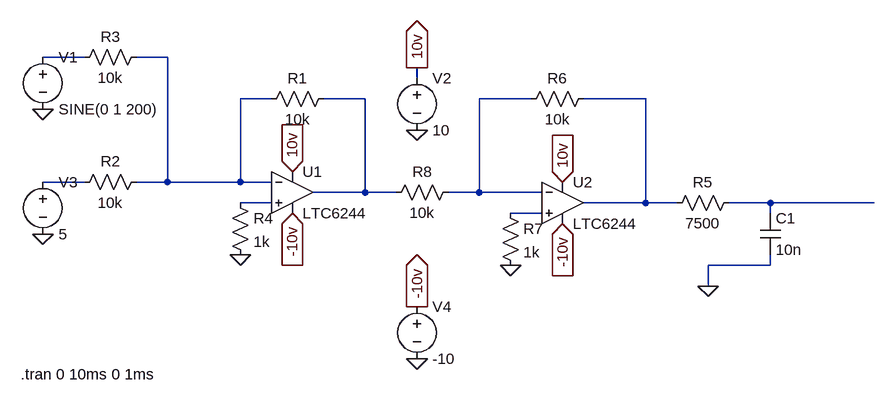
[diagram p0: schematic summing opamp.asc]
summing opamp.asc, the LTspice schematic file:
Version 4
SHEET 1 1268 680
WIRE -128 -80 -192 -80
WIRE 0 -80 -48 -80
WIRE 384 -48 384 -64
WIRE 160 -16 112 -16
WIRE 304 -16 240 -16
WIRE 560 -16 480 -16
WIRE 736 -16 640 -16
WIRE -128 112 -192 112
WIRE 0 112 0 -80
WIRE 0 112 -48 112
WIRE 112 112 112 -16
WIRE 112 112 0 112
WIRE 160 112 112 112
WIRE 304 128 304 -16
WIRE 304 128 224 128
WIRE 352 128 304 128
WIRE 480 128 480 -16
WIRE 480 128 432 128
WIRE 576 128 480 128
WIRE 160 144 112 144
WIRE 736 144 736 -16
WIRE 736 144 640 144
WIRE 784 144 736 144
WIRE 928 144 864 144
WIRE 1088 144 928 144
WIRE 576 160 528 160
WIRE 928 160 928 144
WIRE 928 240 928 224
WIRE 928 240 832 240
WIRE 832 272 832 240
FLAG 384 32 0
FLAG -192 192 0
FLAG 112 224 0
FLAG 384 384 0
FLAG -192 0 0
FLAG 832 272 0
FLAG 528 240 0
FLAG 384 -64 10v
IOPIN 384 -64 Out
FLAG 192 96 10v
IOPIN 192 96 In
FLAG 384 304 -10v
IOPIN 384 304 Out
FLAG 608 112 10v
IOPIN 608 112 In
FLAG 192 160 -10v
IOPIN 192 160 In
FLAG 608 176 -10v
IOPIN 608 176 In
SYMBOL OpAmps\\LTC6244 192 128 R0
SYMATTR InstName U1
SYMBOL res 256 -32 R90
WINDOW 0 0 56 VBottom 2
WINDOW 3 32 56 VTop 2
SYMATTR InstName R1
SYMATTR Value 10k
SYMBOL res -32 96 R90
WINDOW 0 0 56 VBottom 2
WINDOW 3 32 56 VTop 2
SYMATTR InstName R2
SYMATTR Value 10k
SYMBOL res -32 -96 R90
WINDOW 0 0 56 VBottom 2
WINDOW 3 32 56 VTop 2
SYMATTR InstName R3
SYMATTR Value 10k
SYMBOL voltage -192 96 R0
SYMATTR InstName V3
SYMATTR Value 5
SYMBOL res 96 128 R0
SYMATTR InstName R4
SYMATTR Value 1k
SYMBOL voltage 384 288 R0
SYMATTR InstName V4
SYMATTR Value -10
SYMBOL voltage -192 -96 R0
WINDOW 123 0 0 Left 0
WINDOW 39 0 0 Left 0
SYMATTR InstName V1
SYMATTR Value SINE(0 1 200)
SYMBOL voltage 384 -64 R0
SYMATTR InstName V2
SYMATTR Value 10
SYMBOL cap 912 160 R0
SYMATTR InstName C1
SYMATTR Value 10n
SYMBOL res 880 128 R90
WINDOW 0 0 56 VBottom 2
WINDOW 3 32 56 VTop 2
SYMATTR InstName R5
SYMATTR Value 7500
SYMBOL OpAmps\\LTC6244 608 144 R0
SYMATTR InstName U2
SYMBOL res 656 -32 R90
WINDOW 0 0 56 VBottom 2
WINDOW 3 32 56 VTop 2
SYMATTR InstName R6
SYMATTR Value 10k
SYMBOL res 512 144 R0
SYMATTR InstName R7
SYMATTR Value 1k
SYMBOL res 448 112 R90
WINDOW 0 0 56 VBottom 2
WINDOW 3 32 56 VTop 2
SYMATTR InstName R8
SYMATTR Value 10k
TEXT -226 408 Left 2 !.tran 0 10ms 0 1ms

The netlist it stands for:
* summing opamp.asc
XU1 N007 N002 10v -10v N003 LTC6244  ; pins In+ In- V+ V- OUT
R1 N003 N002 10k
R2 N002 N006 10k
R3 N002 N001 10k
V3 N006 0 5
R4 N007 0 1k
V4 -10v 0 -10
V1 N001 0 SINE(0 1 200)
V2 10v 0 10
C1 N008 0 10n
R5 N008 N005 7500
XU2 N009 N004 10v -10v N005 LTC6244  ; pins In+ In- V+ V- OUT
R6 N005 N004 10k
R7 N009 0 1k
R8 N004 N003 10k
.tran 0 10ms 0 1ms
.backanno
.end